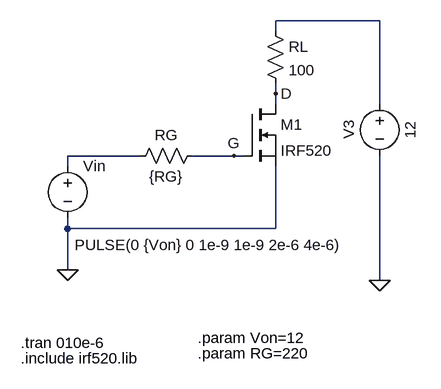
[diagram p0: schematic 400_Dircet_Ctrl.asc]
400_Dircet_Ctrl.asc, the LTspice schematic file:
Version 4.1
SHEET 1 880 680
WIRE 672 -32 512 -32
WIRE 512 -16 512 -32
WIRE 512 80 512 64
WIRE 512 96 512 80
WIRE 672 96 672 -32
WIRE 304 176 192 176
WIRE 448 176 384 176
WIRE 464 176 448 176
WIRE 192 192 192 176
WIRE 192 288 192 272
WIRE 512 288 512 192
WIRE 512 288 192 288
WIRE 192 352 192 288
WIRE 672 368 672 176
FLAG 192 352 0
FLAG 448 176 G
FLAG 672 368 0
FLAG 512 80 D
SYMBOL nmos 464 96 R0
SYMATTR InstName M1
SYMATTR Value IRF520
SYMATTR Prefix X
SYMBOL res 400 160 R90
WINDOW 0 0 56 VBottom 2
WINDOW 3 32 56 VTop 2
SYMATTR InstName RG
SYMATTR Value {RG}
SYMBOL voltage 192 176 R0
WINDOW 3 11 137 Left 2
WINDOW 123 0 0 Left 0
WINDOW 39 0 0 Left 0
SYMATTR Value PULSE(0 {Von} 0 1e-9 1e-9 2e-6 4e-6)
SYMATTR InstName Vin
SYMBOL res 496 -32 R0
SYMATTR InstName RL
SYMATTR Value 100
SYMBOL voltage 672 80 R0
WINDOW 0 -32 56 VBottom 2
WINDOW 3 32 56 VTop 2
WINDOW 123 0 0 Left 0
WINDOW 39 0 0 Left 0
SYMATTR InstName V3
SYMATTR Value 12
TEXT 120 464 Left 2 !.tran 010e-6
TEXT 120 488 Left 2 !.include irf520.lib
TEXT 392 456 Left 2 !.param Von=12
TEXT 392 480 Left 2 !.param RG=220

The netlist it stands for:
* 400_Dircet_Ctrl.asc
X§M1 D G 0 IRF520  ; pins D G S
RG G N002 {RG}
Vin N002 0 PULSE(0 {Von} 0 1e-9 1e-9 2e-6 4e-6)
RL N001 D 100
V3 N001 0 12
.tran 010e-6
.include irf520.lib
.param Von=12
.param RG=220
.backanno
.end